# Altium schematic sheet S7CAS-PLEIADES-CARTE-MERE_TO_BE_DELETED.SchDoc
size Tabloid; SheetNumber: 18; SheetTotal: 18; Size: 11x17; Sheet_Name: Sheet Description
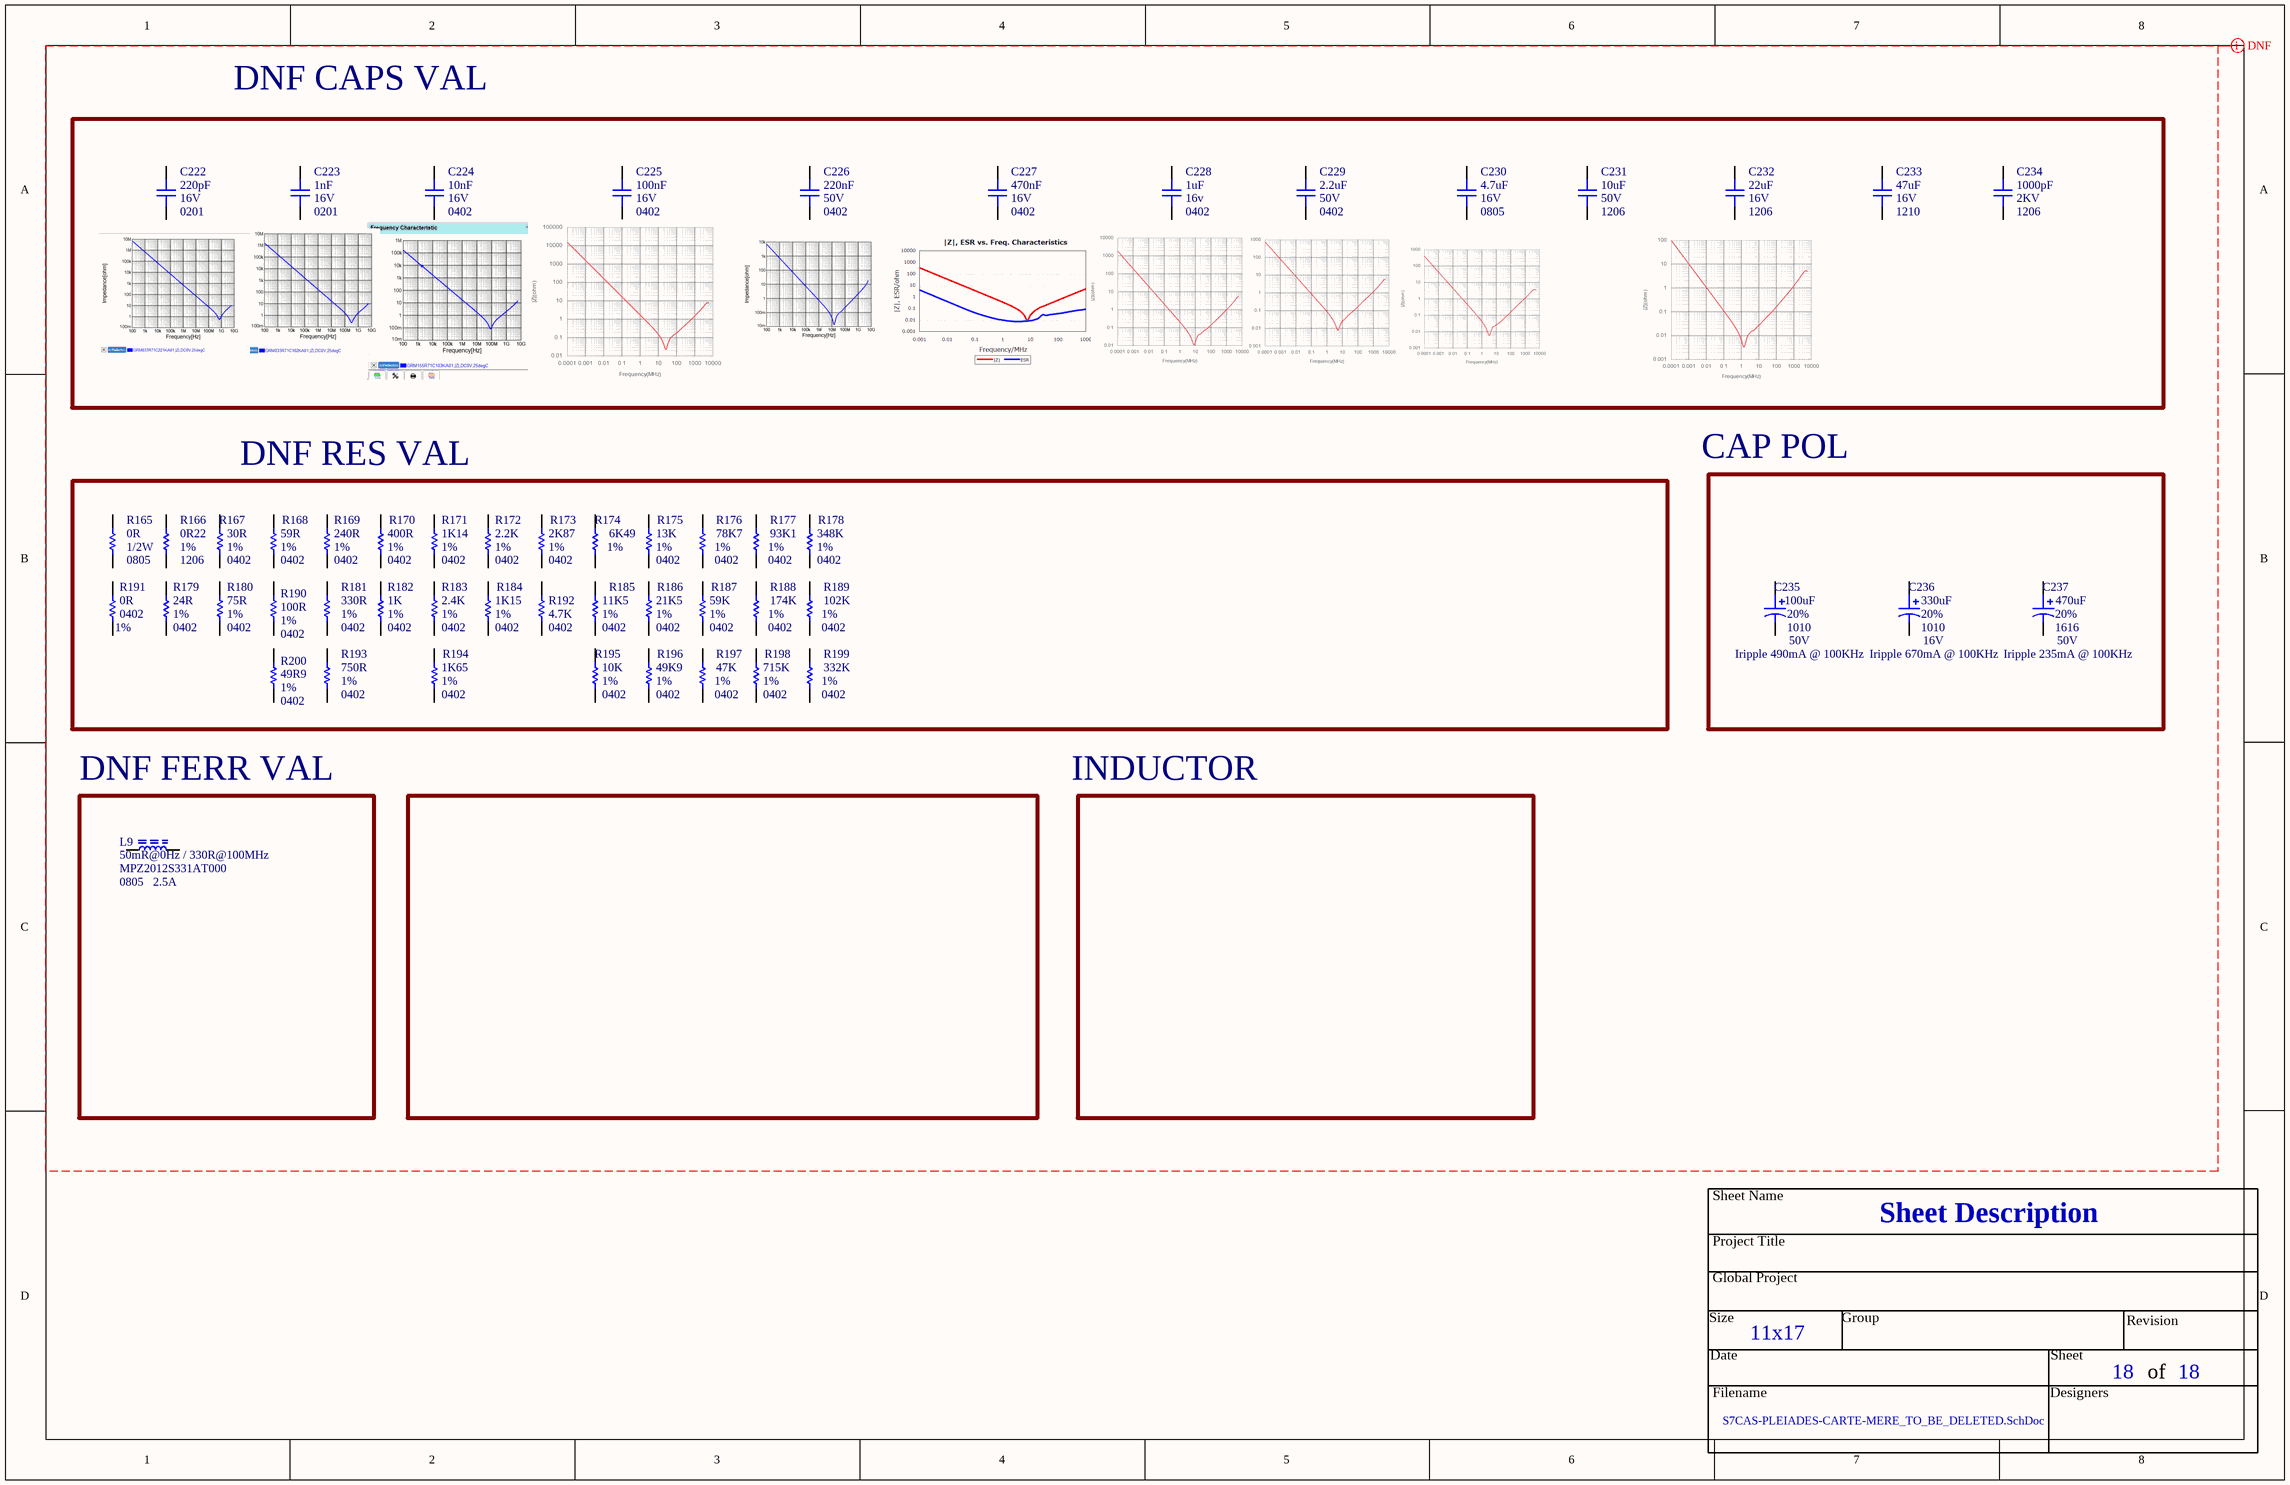
[diagram p0: S7CAS-PLEIADES-CARTE-MERE_TO_BE_DELETED.SchDoc]

## Parts
C222  value 220pF  Voltage: 16V  Package: 0201  [CAP_0201]  (hidden comment: CAP - 0201)
C223  value 1nF  Voltage: 16V  Package: 0201  [CAP_0201]  (hidden comment: CAP - 0201)
C224  value 10nF  Voltage: 16V  Package: 0402  [CAP_0402]  (hidden comment: CAP - 0402)
C225  value 100nF  Voltage: 16V  [CAP_0402]  (hidden comment: 0402)
C226  value 220nF  Voltage: 50V  [CAP_0402]  (hidden comment: 0402)
C227  value 470nF  Voltage: 16V  [CAP_0402]  (hidden comment: 0402)
C228  value 1uF  Voltage: 16v  [CAP_0402]  (hidden comment: 0402)
C229  value 2.2uF  Voltage: 50V  [CAP_0402]  (hidden comment: 0402)
C230  value 4.7uF  Voltage: 16V  Package: 0805  [CAP_0805]  (hidden comment: CAP - 0805)
C231  value 10uF  Voltage: 50V  Package: 1206  [CAP_1206]  (hidden comment: CAP - 1206)
C232  value 22uF  Voltage: 16V  Package: 1206  [CAP_1206]  (hidden comment: CAP - 1206)
C233  value 47uF  Voltage: 16V  Package: 1210  [CAP_1210]  (hidden comment: CAP - 1210)
C234  value 1000pF  Voltage: 2KV  Package: 1206  [CAP_1206]  (hidden comment: CAP - 1206)
C235  value 100uF  Voltage: 50V  Package: 1010  Precision: 20%  [CAP_ALU_1010_vishay]  (hidden comment: MAL215099101E3)
C236  value 330uF  Voltage: 16V  Package: 1010  Precision: 20%  [CAP_ALU_1010_vishay]  (hidden comment: MAL214699501E3)
C237  value 470uF  Voltage: 50V  Package: 1616  Precision: 20%  [CAP_ALU_1616_vishay]  (hidden comment: MAL214699108E3)
L9  value 50mR@0Hz / 330R@100MHz  Mfg Part Number: MPZ2012S331AT000  Current: 2.5A  Package: 0805  [FER_0805]  (hidden comment: FER - 0805)
R165  value 0R  Power: 1/2W  Package: 0805  [RES_0805]  (hidden comment: RES - 0805)
R166  value 0R22  Package: 1206  Precision: 1%  [RES_1206]  (hidden comment: RES - 1206)
R167  value 30R  Package: 0402  Precision: 1%  [RES_0402]  (hidden comment: RES - 0603)
R168  value 59R  Package: 0402  Precision: 1%  [RES_0402]  (hidden comment: RES - 0603)
R169  value 240R  Package: 0402  Precision: 1%  [RES_0402]  (hidden comment: RES - 0603)
R170  value 400R  Package: 0402  Precision: 1%  [RES_0402]  (hidden comment: RES - 0603)
R171  value 1K14  Package: 0402  Precision: 1%  [RES_0402]  (hidden comment: RES - 0402)
R172  value 2.2K  Package: 0402  Precision: 1%  [RES_0402]  (hidden comment: RES - 0603)
R173  value 2K87  Package: 0402  Precision: 1%  [RES_0402]  (hidden comment: RES - 0603)
R174  value 6K49  Precision: 1%  [RES_0402]  (hidden comment: RES - 0402)
R175  value 13K  Package: 0402  Precision: 1%  [RES_0402]  (hidden comment: RES - 0603)
R176  value 78K7  Package: 0402  Precision: 1%  [RES_0402]  (hidden comment: RES - 0603)
R177  value 93K1  Package: 0402  Precision: 1%  [RES_0402]  (hidden comment: RES - 0603)
R178  value 348K  Package: 0402  Precision: 1%  [RES_0402]  (hidden comment: RES - 0603)
R179  value 24R  Package: 0402  Precision: 1%  [RES_0402]  (hidden comment: RES - 0402)
R180  value 75R  Package: 0402  Precision: 1%  [RES_0402]  (hidden comment: RES - 0603)
R181  value 330R  Package: 0402  Precision: 1%  [RES_0402]  (hidden comment: RES - 0603)
R182  value 1K  Package: 0402  Precision: 1%  [RES_0402]  (hidden comment: RES - 0603)
R183  value 2.4K  Package: 0402  Precision: 1%  [RES_0402]  (hidden comment: RES - 0603)
R184  value 1K15  Package: 0402  Precision: 1%  [RES_0402]  (hidden comment: RES - 0603)
R185  value 11K5  Package: 0402  Precision: 1%  [RES_0402]  (hidden comment: RES - 0603)
R186  value 21K5  Package: 0402  Precision: 1%  [RES_0402]  (hidden comment: RES - 0603)
R187  value 59K  Package: 0402  Precision: 1%  [RES_0402]  (hidden comment: RES - 0603)
R188  value 174K  Package: 0402  Precision: 1%  [RES_0402]  (hidden comment: RES - 0603)
R189  value 102K  Package: 0402  Precision: 1%  [RES_0402]  (hidden comment: RES - 0603)
R190  value 100R  Package: 0402  Precision: 1%  [RES_0402]  (hidden comment: RES - 0603)
R191  value 0R  Package: 0402  Precision: 1%  [RES_0402]  (hidden comment: RES - 0603)
R192  value 4.7K  Package: 0402  [RES_0402]  (hidden comment: RES - 0603)
R193  value 750R  Package: 0402  Precision: 1%  [RES_0402]  (hidden comment: RES - 0603)
R194  value 1K65  Package: 0402  Precision: 1%  [RES_0402]  (hidden comment: RES - 0603)
R195  value 10K  Package: 0402  Precision: 1%  [RES_0402]  (hidden comment: RES - 0603)
R196  value 49K9  Package: 0402  Precision: 1%  [RES_0402]  (hidden comment: RES - 0603)
R197  value 47K  Package: 0402  Precision: 1%  [RES_0402]  (hidden comment: RES - 0603)
R198  value 715K  Package: 0402  Precision: 1%  [RES_0402]  (hidden comment: RES - 0603)
R199  value 332K  Package: 0402  Precision: 1%  [RES_0402]  (hidden comment: RES - 0603)
R200  value 49R9  Package: 0402  Precision: 1%  [RES_0402]  (hidden comment: RES - 0603)

## Blocks framed on the sheet
DNF RES VAL: R165-R200
DNF FERR VAL: L9

## Nets

Not connected (* = marked no-connect by the designer): C222 1 2; C223 1 2; C224 1 2; C225 1 2; C226 1 2; C227 1 2; C228 1 2; C229 1 2; C230 1 2; C231 1 2; C232 1 2; C233 1 2; C234 1 2; C235 1 2; C236 1 2; C237 1 2; L9 1 2; R165 1 2; R166 1 2; R167 1 2; R168 1 2; R169 1 2; R170 1 2; R171 1 2; R172 1 2; R173 1 2; R174 1 2; R175 1 2; R176 1 2; R177 1 2; R178 1 2; R179 1 2; R180 1 2; R181 1 2; R182 1 2; R183 1 2; R184 1 2; R185 1 2; R186 1 2; R187 1 2; R188 1 2; R189 1 2; R190 1 2; R191 1 2; R192 1 2; R193 1 2; R194 1 2; R195 1 2; R196 1 2; R197 1 2; R198 1 2; R199 1 2; R200 1 2

## Layout directives
CompClassName: DNF_CLASS_COMPONENT: (no net found under the mark)

## Notes on the sheet
- DNF CAPS VAL
- CAP POL
- (near C235) Iripple 490mA @ 100KHz
- (near C236) Iripple 670mA @ 100KHz
- (near C237) Iripple 235mA @ 100KHz
- INDUCTOR
- Sheet Name
- Project Title
- Global Project
- Revision
- Size
- Date
- Group
- Sheet
- of
- Filename
- Designers

## Library data of the parts
C222 C223 = CAP - 0201: Precision: 10%; Current: *; CreatedBy: Jonathan Bouchard; Power: *
  C222: Supplier 1: Arrow Electronics; Supplier Part Number 1: GRM033R71C221KA01D
  C223: Supplier 1: Avnet; Supplier Part Number 1: GRM033R71C102KA01J
C224 = CAP - 0402: Precision: 10%; Current: *; CreatedBy: Jonathan Bouchard; Power: *; Supplier 1: Arrow Electronics; Supplier Part Number 1: GRM155R61A224KE19D
C225-C229 = CAP - 0603: CAP - 0402; Precision: 10%; Current: *; CreatedBy: Jonathan Bouchard; Power: *; Package: 0402; Supplier 1: Arrow Electronics
  C225: Supplier Part Number 1: CL10B104KO8NNNC
  C226: Supplier Part Number 1: GRM188R71H224KAC4D
  C227: Supplier Part Number 1: C1608X7R1C474K080AC
  C228: Supplier Part Number 1: CL10B105MO8NNWC
  C229: Supplier Part Number 1: GRM188R61H225KE11D
C230 = CAP - 0805: Precision: 10%; Current: *; CreatedBy: Jonathan Bouchard; Power: *; Supplier 1: Arrow Electronics; Supplier Part Number 1: CL21B475KOFNFNE
C231 C232 C234 = CAP - 1206: Precision: 10%; Current: *; CreatedBy: Jonathan Bouchard; Power: *
  C231: Supplier 1: Avnet; Supplier Part Number 1: CL31A106MBHNNNE
  C232: Supplier 1: Arrow Electronics; Supplier Part Number 1: CL31A226MOCLNNC
  C234: Supplier 1: Arrow Electronics; Supplier Part Number 1: 1206GC102KAT1A
C233 = CAP - 1210: Precision: 10%; Current: *; CreatedBy: Jonathan Bouchard; Power: *; Supplier 1: Arrow Electronics; Supplier Part Number 1: CL32A476KOJNNNE
C235 = CAP_ALU_MAL215099101E3: CAP - ALU 100uF 20% 50V - 1010; Current: 490mA; Mfg: Vishay Dale; Mfg Part Number: MAL215099101E3; HelpURL: http://www.vishay.com/docs/28395/150crz.pdf; CreatedBy: Jonathan Bouchard; Temperature: -55°C to 125°C; Power: *; Supplier 1: Digikey; Supplier Part Number 1: 4399PHDKR-ND
C236 = CAP_ALU_MAL214699501E3: CAP - ALU 330uF 20% 16V - 1010; Current: 750mA; Mfg: Vishay Dale; Mfg Part Number: MAL214699501E3; HelpURL: http://www.vishay.com/docs/28403/146cti.pdf; CreatedBy: Jonathan Bouchard; Temperature: -55°C to 125°C; Power: *; Supplier 1: Digikey; Supplier Part Number 1: 4405PHCT-ND
C237 = CAP_ALU_MAL214699108E3: CAP - ALU 470uF 20% 50V - 1616; Current: 1.3A; Mfg: Vishay Dale; Mfg Part Number: MAL214699108E3; HelpURL: http://www.vishay.com/docs/28403/146cti.pdf; CreatedBy: Jonathan Bouchard; Temperature: -55°C to 125°C; Power: *; Supplier 1: Digikey; Supplier Part Number 1: 4442PHCT-ND
L9 = FER - 0805: Mfg: TDK Corporation; Voltage: *; CreatedBy: Jonathan Bouchard; Power: *; Precision: *; Supplier 1: Arrow Electronics; Supplier Part Number 1: MPZ2012S331AT000
R165 = RES - 0805: Precision: 1%; Current: *; CreatedBy: Jonathan Bouchard; Supplier 1: Arrow Electronics; Supplier Part Number 1: HCJ0805ZT0R00
R167-R170 R172 R173 R175-R178 R180-R191 R193-R200 = RES - 0603: RES - 0402; Current: *; CreatedBy: Jonathan Bouchard
  R167: Supplier 1: Arrow Electronics; Supplier Part Number 1: RMCF0603FT30R0
  R168: Supplier 1: Digikey; Supplier Part Number 1: 738-RMCF0603FT59R0CT-ND
  R169: Supplier 1: Arrow Electronics; Supplier Part Number 1: RMCF0603FT240R
  R170: Supplier 1: Mouser; Supplier Part Number 1: 71-PAT0603E4000BST1
  R172: Supplier 1: Newark; Supplier Part Number 1: 94X1502
  R173: Supplier 1: Arrow Electronics; Supplier Part Number 1: RMCF0603FT2K87
  R175: Supplier 1: Arrow Electronics; Supplier Part Number 1: RMCF0603FT13K0
  R176: Supplier 1: Arrow Electronics; Supplier Part Number 1: RMCF0603FT78K7
  R177: Supplier 1: Arrow Electronics; Supplier Part Number 1: RMCF0603FT93K1
  R178: Supplier 1: Arrow Electronics; Supplier Part Number 1: RMCF0603FT348K
  R180: Supplier 1: Arrow Electronics; Supplier Part Number 1: RMCF0603FT75R0
  R181: Supplier 1: Arrow Electronics; Supplier Part Number 1: RMCF0603FT330R
  R182: Supplier 1: Arrow Electronics; Supplier Part Number 1: RMCF0603FT1K00
  R183: Supplier 1: Mouser; Supplier Part Number 1: 603-RC0603FR-132K4L
  R184: Supplier 1: Arrow Electronics; Supplier Part Number 1: RMCF0603FT1K15
  R185: Supplier 1: Arrow Electronics; Supplier Part Number 1: RMCF0603FT11K5
  R186: Supplier 1: Arrow Electronics; Supplier Part Number 1: RMCF0603FT21K5
  R187: Supplier 1: Arrow Electronics; Supplier Part Number 1: RMCF0603FT59K0
  R188: Supplier 1: Arrow Electronics; Supplier Part Number 1: RMCF0603FT174K
  R189: Supplier 1: Arrow Electronics; Supplier Part Number 1: RMCF0603FT102K
  R190: Supplier 1: Arrow Electronics; Supplier Part Number 1: RMCF0603FT100R
  R191: Supplier 1: Arrow Electronics; Supplier Part Number 1: RMCF0603ZT0R00
  R193: Supplier 1: Arrow Electronics; Supplier Part Number 1: RMCF0603FT750R
  R194: Supplier 1: Arrow Electronics; Supplier Part Number 1: RMCF0603FT1K65
  R195: Supplier 1: Arrow Electronics; Supplier Part Number 1: RMCF0603FT10K0
  R196: Supplier 1: Digikey; Supplier Part Number 1: RMCF0603FG49K9CT-ND
  R197: Supplier 1: Arrow Electronics; Supplier Part Number 1: RMCF0603FT47K0
  R198: Supplier 1: Digikey; Supplier Part Number 1: 738-RMCF0603FT715KCT-ND
  R199: Supplier 1: Arrow Electronics; Supplier Part Number 1: RMCF0603FT332K
  R200: Supplier 1: Mouser; Supplier Part Number 1: 667-ERJ-3EKF49R9V
R171 R174 R179 = RES - 0402: Voltage: 50V; Power: 1/16W; Current: *; CreatedBy: Jonathan Bouchard
  R171: Supplier 1: Digikey; Supplier Part Number 1: 2019-RN73H1ETTP1141F50CT-ND
  R174: Package: 0402; Supplier 1: Mouser; Supplier Part Number 1: 652-CR0402-FX6491GLF
  R179: Supplier 1: Arrow Electronics; Supplier Part Number 1: RC0402FR-0724RL
R192 = RES - 0603: RES - 0402; Precision: 1%; Current: *; CreatedBy: Jonathan Bouchard; Supplier 1: Arrow Electronics; Supplier Part Number 1: RMCF0603FT4K70
R166 = RES - 1206: Current: *; CreatedBy: Jonathan Bouchard; Supplier 1: Mouser; Supplier Part Number 1: 667-ERJ-8RQFR22V